# Altium schematic sheet Power Supply.SchDoc
size A4; SheetNumber: 3; SheetTotal: 9
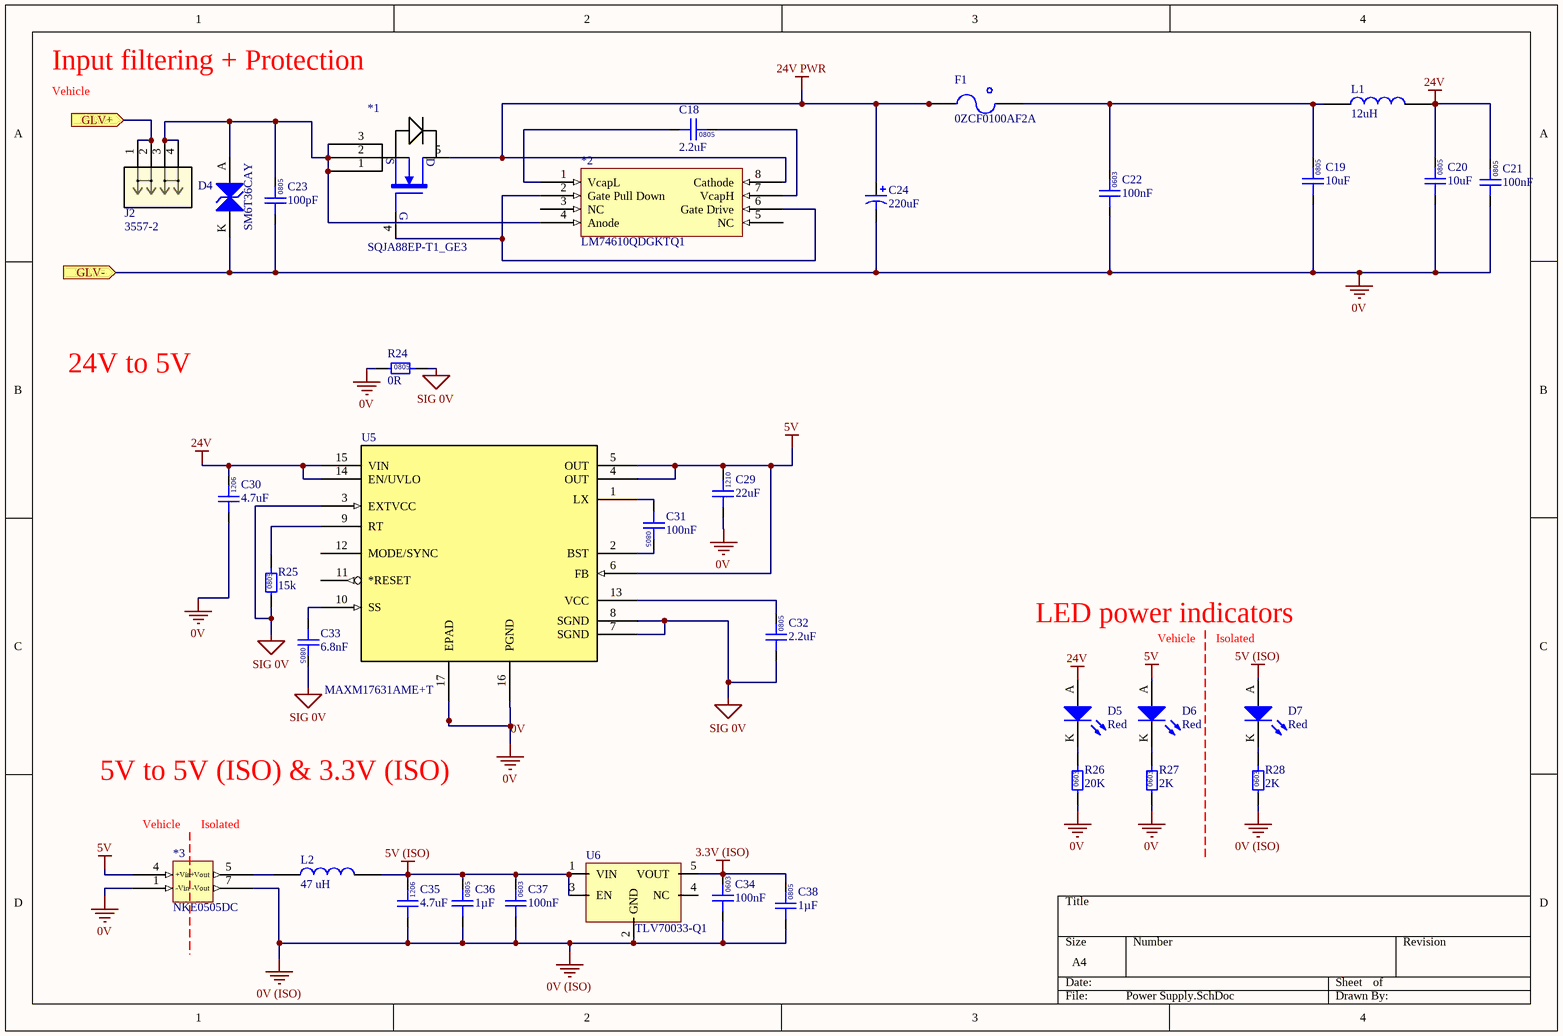
[diagram p0: Power Supply.SchDoc]

## Parts
*1  SQJA88EP-T1_GE3  [PowerPak SO-8]
*2  LM74610QDGKTQ1  [SOP65P490X110-8N]
*3  NKE0505DC  [NKE0505DC]
C18  2.2uF  [0805]
C19  10uF  [0805]
C20  10uF  [0805]
C21  100nF  [0805]
C22  100nF  [0603]
C23  100pF  [0805]
C24  220uF  [Vishay Radial 1213]
C29  22uF  [1210]
C30  4.7uF  [1206 CAP]
C31  100nF  [0805]
C32  2.2uF  [0805]
C33  6.8nF  [0805]
C34  100nF  [0603]
C35  4.7uF  [1206 CAP]
C36  1µF  [0805]
C37  100nF  [0603]
C38  1µF  [0805]
D4  SM6T36CAY  [ST SMB DIODE]
D5  Red  [0805 LED]
D6  Red  [0805 LED]
D7  Red  [0805 LED]
F1  0ZCF0100AF2A  [2920]
J2  3557-2  [35572]
L1  12uH  [1812]
L2  47 uH  [82473C]
R24  0R  [0805]
R25  15k  [0805]
R26  20K  [0603]
R27  2K  [0603]
R28  2K  [0603]
U5  MAXM17631AME+T  [MAXM17631AME+T]
U6  TLV70033-Q1  [TI SOT-23-5]

## Ports
GLV+ (in), GLV- (in)

## Nets
0V: *3.1(-Vin) C19.1 C20.1 C21.1 C22.1 C23.1 C24.1 C29.1 C30.1 D4.K R24.1 R26.1 R27.1 U5.16(PGND) U5.17(EPAD) ; port GLV-
0V (ISO): *3.7(-Vout) C34.1 C35.1 C36.1 C37.1 C38.1 R28.1 U6.2(GND)
3.3V (ISO): C34.2 C38.2 U6.5(VOUT)
5V: *3.4(+Vin) C29.2 D6.A U5.4(OUT) U5.5(OUT) U5.6(FB)
5V (ISO): C35.2 C36.2 C37.2 D7.A L2.1 U6.1(VIN) U6.3(EN)
24V: C20.2 C21.2 C30.2 D5.A L1.1 U5.14(EN/UVLO) U5.15(VIN)
24V PWR: *1.5(D) *2.8(Cathode) C24.2 F1.1
SIG 0V: C32.1 C33.2 R24.2 R25.1 U5.3(EXTVCC) U5.7(SGND) U5.8(SGND)
GLV+: J2.1 J2.2 ; port GLV+
Net*1_1: *1.1(S1) *1.2(S2) *1.3(S3) *2.4(Anode) C23.2 D4.A J2.3 J2.4
Net*1_4: *1.4(G) *2.2(Gate_Pull_Down) *2.6(Gate_Drive)
Net*2_1: *2.1(VcapL) C18.1
Net*2_7: *2.7(VcapH) C18.2
Net*3_5: *3.5(+Vout) L2.2
NetC19_2: C19.2 C22.2 F1.2 L1.2
NetC31_1: C31.1 U5.1(LX)
NetC31_2: C31.2 U5.2(BST)
NetC32_2: C32.2 U5.13(VCC)
NetC33_1: C33.1 U5.10(SS)
NetD5_K: D5.K R26.2
NetD6_K: D6.K R27.2
NetD7_K: D7.K R28.2
NetR25_2: R25.2 U5.9(RT)

Not connected (* = marked no-connect by the designer): *2 3(NC) 5(NC); U5 11(*RESET) 12(MODE/SYNC); U6 4(NC)

## Notes on the sheet
- Input filtering + Protection
- Vehicle
- 24V to 5V
- Star point grounding for signal GND
- LED power indicators
- Isolated
- (near U5) Css (soft start capacitor) tss = (Css/(5.55*10^-6)) = 1.225ms
- 5V to 5V (ISO) & 3.3V (ISO)
- (near *3) Vehicle
- (in symbol GCM21BR71H104KA37L) 0805
- (in symbol GCM21BR71H105KA03L) 0805
- (in symbol GCM188L81H104KA57D) 0603
- (in symbol GCM2165C1H101JA16D) 0805
- (in symbol GCM2195C1H682JA16D) 0805
- (in symbol GRM21BR6YA106KE43L) 0805
- (in symbol GRM21BR71E225KE11L) 0805
- (in symbol GRM31CR71H475KA12K) 1206
- (in symbol GRM32ER71E226KE15L) 1210
- (in symbol RC0603FR-072KL) 0603
- (in symbol RC0603FR-0720KL) 0603
- (in symbol RC0805FR070RL) 0805
- (in symbol RC0805FR0715KL) 0805
- (in symbol SQJA88EP-T1_GE3) S

## Library data of the parts
*1 = SQJA88EP-T1_GE3: MOSFET N-CH 40V 30A PPAK SO-8; Manufacturer: Vishay Siliconix; Rated Power: 48W; Part Number: SQJA88EP-T1_GE3; Type: N-channel; Digikey Part Number: 742-SQJA88EP-T1_GE3TR-ND
*2 = LM74610QDGKTQ1: Hot Swap Voltage Controllers Zero Iq Reverse Polarity Protection; Manufacturer: Texas Instruments; Part Number: LM74610QDGKTQ1
*3 = NKE0505DC: DC DC CONVERTER 5V 1W; Manufacturer: Murata Power Solutions Inc.; Input Voltage: 4.5 to 5.5; Output Current: 200 mA; Part Number: NKE0505DC; Output Voltage: 5V; Digikey Part Number: 811-1433-5-ND
C18 C32 = GRM21BR71E225KE11L: Manufacturer: Murata Electronics; Rated Voltage: 25V; Tolerance: ±10%; Material: MLCC; Temperature Rating: X7R; Part Number: GRM21BR71E225KE11L; Value: 2.2uF; Digikey Part Number: 490-14467-2-ND
C19 C20 = GRM21BR6YA106KE43L: Manufacturer: muRata; Rated Voltage: 50V; Tolerance: 10%; Material: MLCC; Temperature Rating: X5R; Part Number: GRM21BR6YA106KE43L; Value: 10uF; Digikey Part Number: 490-10514-6-ND
C21 C31 = GCM21BR71H104KA37L: Manufacturer: muRata; Rated Voltage: 50V; Tolerance: ±10%; Material: MLCC; Temperature Rating: X7R; Part Number: GCM21BR71H104KA37L; Value: 100nF; Digikey Part Number: 490-6064-1-ND
C22 C34 C37 = GCM188L81H104KA57D: Manufacturer: muRata; Rated Voltage: 50V; Tolerance: ±10%; Material: MLCC; Temperature Rating: X8L; Part Number: GCM188L81H104KA57D; Value: 100nF; Digikey Part Number: 490-6049-1-ND
C23 = GCM2165C1H101JA16D: Manufacturer: muRata; Rated Voltage: 50V; Tolerance: ±5%; Material: MLCC; Temperature Rating: C0G, NP0; Part Number: GCM2165C1H101JA16D; Value: 100pF; Digikey Part Number: 490-8031-1-ND
C24 = MAL214699106E3: Manufacturer: Vishay; Rated Voltage: 50V; Tolerance: 20%; Material: Aluminium Electrolytic; Temperature Rating: 125C; Part Number: MAL214699106E3; Value: 220uF; Digikey Part Number: 4440PHCT-ND
C29 = GRM32ER71E226KE15L: Manufacturer: Murata Electronics; Rated Voltage: 25V; Tolerance: ±10%; Material: MLCC; Temperature Rating: X7R; Part Number: GRM32ER71E226KE15L; Value: 22uF; Digikey Part Number: 490-5313-2-ND
C30 C35 = GRM31CR71H475KA12K: Manufacturer: Murata Electronics; Rated Voltage: 50V; Tolerance: ±10%; Material: MLCC; Temperature Rating: X7R; Part Number: GRM31CR71H475KA12K; Value: 4.7uF; Digikey Part Number: 490-GRM31CR71H475KA12KTR-ND
C33 = GCM2195C1H682JA16D: Manufacturer: muRata; Rated Voltage: 50V; Tolerance: ±5%; Material: MLCC; Temperature Rating: C0G, NP0; Part Number: GCM2195C1H682JA16D; Value: 6.8nF; Digikey Part Number: 490-4974-1-ND
C36 C38 = GCM21BR71H105KA03L: Manufacturer: muRata; Rated Voltage: 50V; Tolerance: ±10%; Material: MLCC; Temperature Rating: X7R; Part Number: GCM21BR71H105KA03L; Value: 1µF; Digikey Part Number: 490-10675-1-ND
D4 = SM6T36CAY: Manufacturer: STMicroelectronics; Forward Voltage: 30.8 V; Rated Power: 600W; Part Number: SM6T36CAY; Breakdown Voltage: 30.8 V; Digikey Part Number: 497-10804-1-ND
D5-D7 = SML-210LTT86: Red LED Indication - Discrete 1.75V 0805 (2012 Metric); Manufacturer: ROHM Semiconductor; Part Number: SML-210LTT86; Colour: Red; Digikey Part Number: 511-1286-1-ND
F1 = 0ZCF0100AF2A: PTC RESET FUSE 60V 1A 292; Manufacturer: Littelfuse Inc.; Part Number: 0ZCF0100AF2A; Digikey Part Number: 507-2070-1-ND; Digikey Link: https://www.digikey.com/product-detail/en/bel-fuse-inc/0ZCF0100AF2A/507-2070-1-ND/6210547
J2 = 3557-2: FUSE BLOCK BLADE 500V 30A PCB; Mfr_Name: Keystone Electronics; Copyright: Copyright (C) 2023 Ultra Librarian. All rights reserved.; Manufacturer_Part_Number: 3557-2; Digi-Key_Part_Number_1: 3557-2K-ND; Digi-Key_Part_Number_2: 36-3557-2-ND; Digi-Key_Part_Number_3: 36-3557-2-NDL; RefDes: RefDes; Type: DEV; Part Number: 3557-2; Manufacturer: Keystone Electronics; Digikey Part Number: 36-3557-2-ND; Digikey Link: https://www.digikey.com.au/en/products/detail/keystone-electronics/3557-2/2137305?utm_adgroup=General&utm_source=google&utm_medium=cpc&utm_campaign=PMax%20Shopping_Product_Zombie%20SKUs&utm_term=&productid=2137305&utm_id=go_cmp-17853854068_adg-_ad-__dev-c_ext-_prd-2137305_sig-Cj0KCQjw9MCnBhCYARIsAB1WQVVuVnExTR_F6-Mn3-SBphXD6FivM1Reay6dOEaGii4CYk9YgAW6_PQaAhcnEALw_wcB&gad=1&gclid=Cj0KCQjw9MCnBhCYARIsAB1WQVVuVnExTR_F6-Mn3-SBphXD6FivM1Reay6dOEaGii4CYk9YgAW6_PQaAhcnEALw_wcB
L1 = RLS-126: Manufacturer: Recom; Tolerance: 0.2; Material: Wirewound; Impedance: 230mOhm; Rated Current: 0.8 A; Part Number: RLS-126; Value: 12uH; Digikey Part Number: 945-3429-ND
L2 = 82473C: Manufacturer: Murata Power Solutions Inc.; Tolerance: 0.1; Impedance: 1.69 Ohms; Rated Current: 250mA; Material: Wirewound; Part Number: 82473C; Value: 47 uH; Digikey Part Number: 811-2477-2-ND
R24 = RC0805FR070RL: Manufacturer: YAGEO; Tolerance: 0.01; Rated Power: 0.125W; Part Number: RC0805FR070RL; Value: 0R; Material: FR-07; Digikey Part Number: 311-0.0CRCT-ND
R25 = RC0805FR0715KL: Manufacturer: YAGEO; Tolerance: 0.01; Rated Power: 0.125W; Part Number: RC0805FR0715KL; Value: 15k; Material: FR-07; Digikey Part Number: 311-15.0KCRCT-ND
R26 = RC0603FR-0720KL: Manufacturer: YAGEO; Tolerance: 0.01; Rated Power: 0.1W; Part Number: RC0603FR-0720KL; Value: 20K; Digikey Part Number: 311-20.0KHRCT-ND
R27 R28 = RC0603FR-072KL: Manufacturer: YAGEO; Tolerance: 0.01; Rated Power: 0.1W; Part Number: RC0603FR-072KL; Value: 2K; Digikey Part Number: 311-2.00KHRCT-ND
U5 = MAXM17631AME+T: DC DC CONVERTER 5V; Mfr_Name: Analog Devices Inc; Manufacturer: Analog Devices; Input Voltage: 4.5 to 36 V; Output Current: 1.0 A; Digi-Key_Part_Number_1: 175-MAXM17631AME+TTR-ND; RefDes: RefDes; Type: Type; Part Number: MAXM17631AME+T; Output Voltage: 5V; Digikey Part Number: 175-MAXM17631AME+TTR-ND
U6 = TLV70033-Q1: IC REG LINEAR 3.3V 200MA SOT23-5; Manufacturer: Texas Instruments; Input Voltage: 2 to 5.5 V; Output Current: 0.2 A; Part Number: TLV70033-Q1; Output Voltage: 3.3 V; Digikey Part Number: 296-27780-1-ND